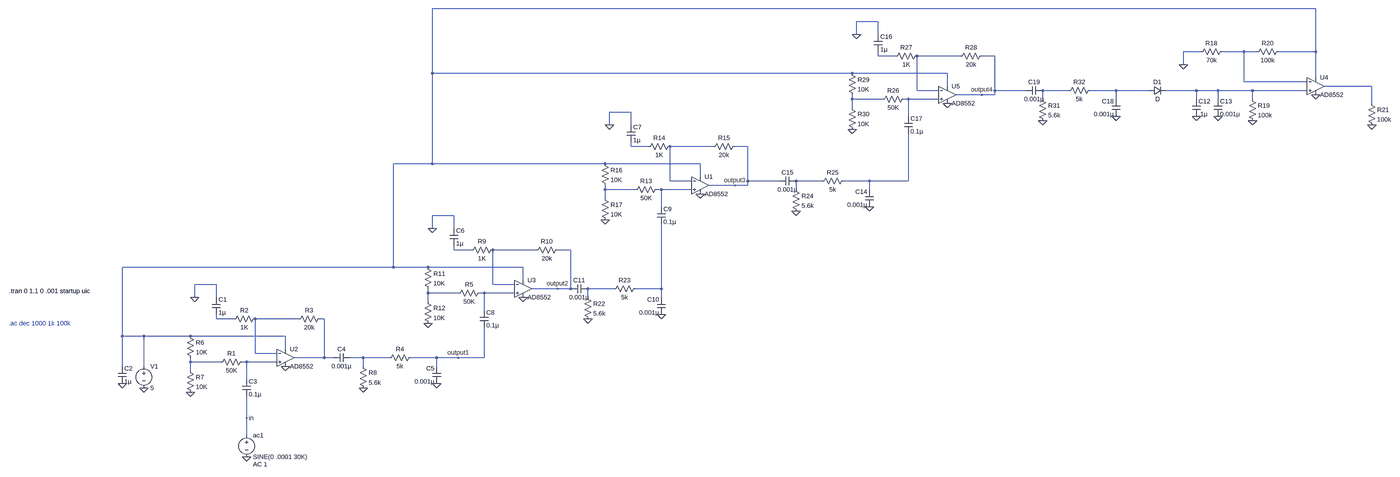
[diagram p0: schematic Kyles Amp Circuit.asc, whole sheet]
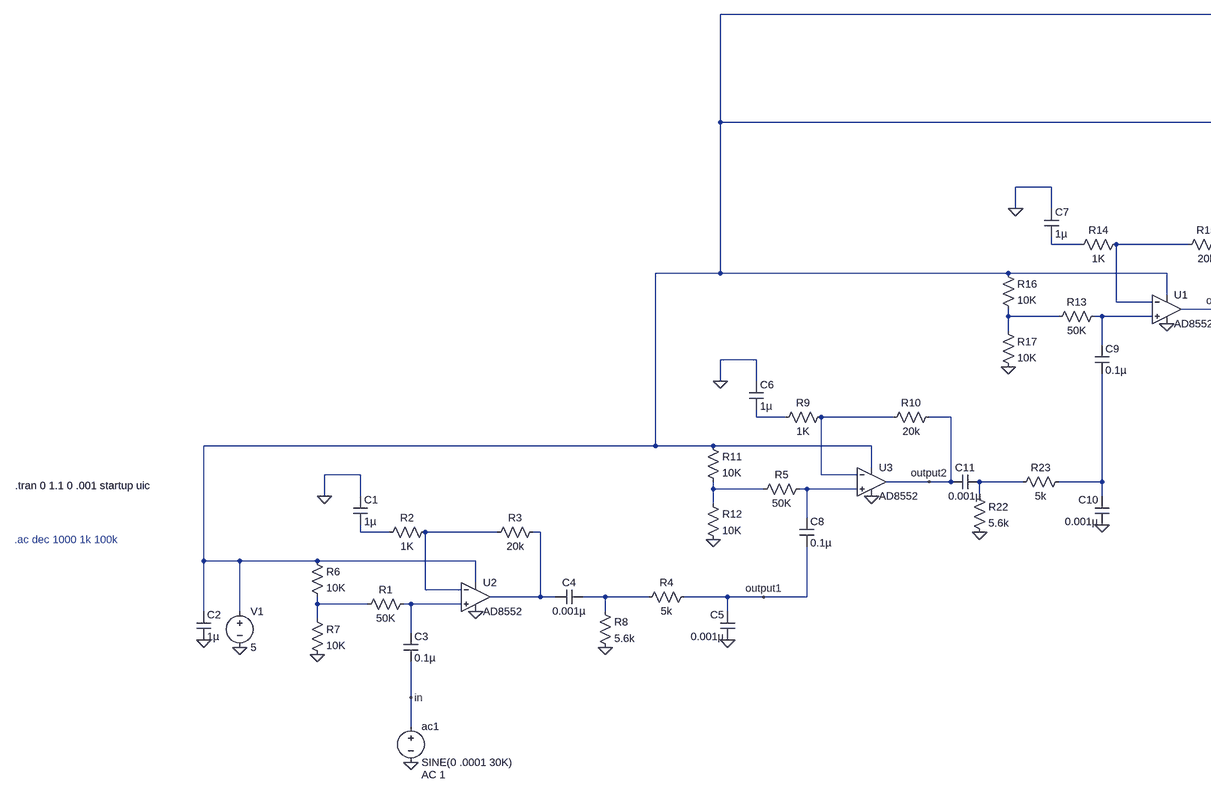
[diagram p1: schematic Kyles Amp Circuit.asc, part, row 1 of 1, column 1 of 2]
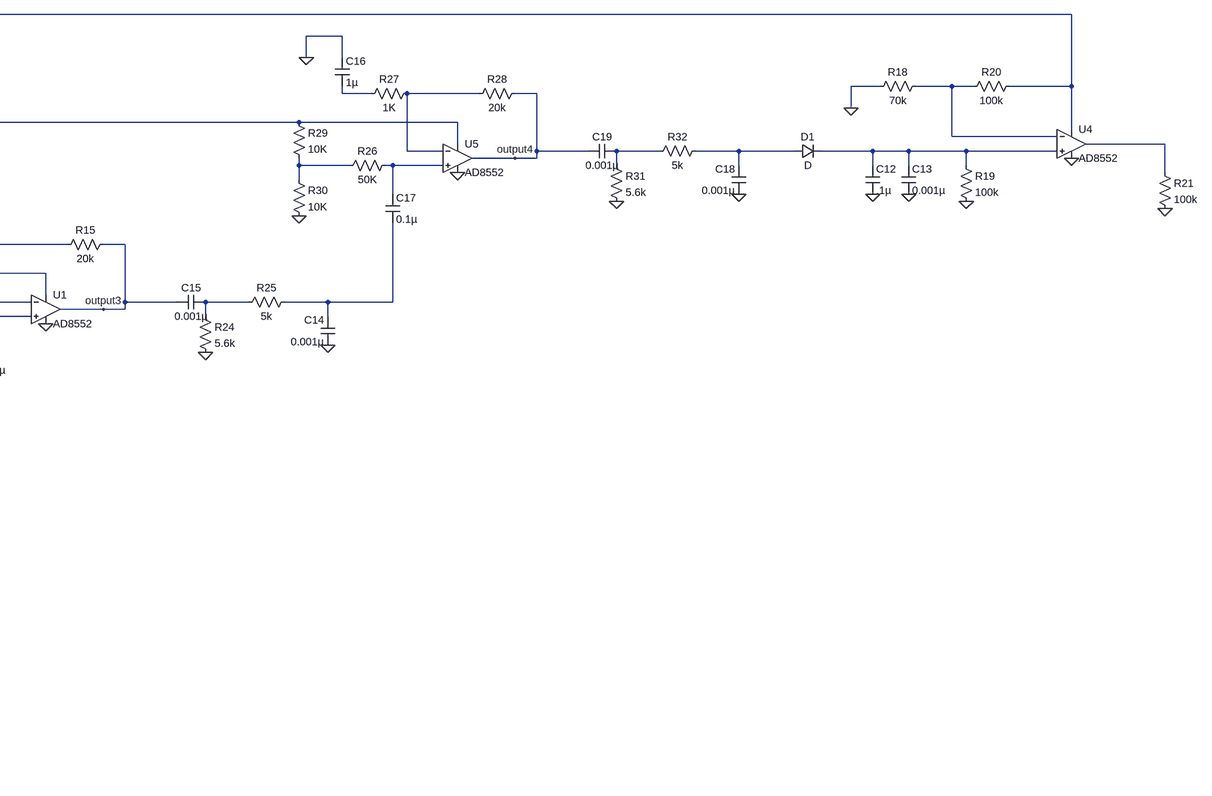
[diagram p2: schematic Kyles Amp Circuit.asc, part, row 1 of 1, column 2 of 2]
Kyles Amp Circuit.asc, the LTspice schematic file:
Version 4
SHEET 1 4688 692
WIRE 4400 -1168 992 -1168
WIRE 2688 -1120 2608 -1120
WIRE 2608 -1072 2608 -1120
WIRE 2688 -1072 2688 -1120
WIRE 3936 -1008 3872 -1008
WIRE 4096 -1008 4016 -1008
WIRE 4144 -1008 4096 -1008
WIRE 4400 -1008 4400 -1168
WIRE 4400 -1008 4224 -1008
WIRE 2688 -992 2688 -1008
WIRE 2752 -992 2688 -992
WIRE 2992 -992 2832 -992
WIRE 3120 -992 3072 -992
WIRE 3872 -960 3872 -1008
WIRE 992 -928 992 -1168
WIRE 2592 -928 992 -928
WIRE 2944 -928 2592 -928
WIRE 4400 -912 4400 -1008
WIRE 4096 -896 4096 -1008
WIRE 4368 -896 4096 -896
WIRE 2944 -880 2944 -928
WIRE 4608 -880 4432 -880
WIRE 2832 -864 2832 -992
WIRE 2912 -864 2832 -864
WIRE 3120 -864 3120 -992
WIRE 3280 -864 3120 -864
WIRE 3440 -864 3344 -864
WIRE 3616 -864 3520 -864
WIRE 3744 -864 3616 -864
WIRE 3920 -864 3808 -864
WIRE 4000 -864 3920 -864
WIRE 4128 -864 4000 -864
WIRE 4368 -864 4128 -864
WIRE 3072 -848 2976 -848
WIRE 3120 -848 3120 -864
WIRE 3120 -848 3072 -848
WIRE 2592 -832 2592 -848
WIRE 2704 -832 2592 -832
WIRE 2800 -832 2784 -832
WIRE 2912 -832 2800 -832
WIRE 3344 -832 3344 -864
WIRE 3616 -832 3616 -864
WIRE 3920 -832 3920 -864
WIRE 4000 -832 4000 -864
WIRE 4128 -832 4128 -864
WIRE 4608 -816 4608 -880
WIRE 2592 -800 2592 -832
WIRE 1728 -784 1648 -784
WIRE 2800 -768 2800 -832
WIRE 1648 -736 1648 -784
WIRE 1728 -736 1728 -784
WIRE 1728 -656 1728 -672
WIRE 1792 -656 1728 -656
WIRE 2032 -656 1872 -656
WIRE 2160 -656 2112 -656
WIRE 992 -592 992 -928
WIRE 992 -592 848 -592
WIRE 1632 -592 992 -592
WIRE 1984 -592 1632 -592
WIRE 1984 -544 1984 -592
WIRE 1872 -528 1872 -656
WIRE 1952 -528 1872 -528
WIRE 2160 -528 2160 -656
WIRE 2320 -528 2160 -528
WIRE 2480 -528 2384 -528
WIRE 2656 -528 2560 -528
WIRE 2800 -528 2800 -704
WIRE 2800 -528 2656 -528
WIRE 2112 -512 2016 -512
WIRE 2160 -512 2160 -528
WIRE 2160 -512 2112 -512
WIRE 1632 -496 1632 -512
WIRE 1744 -496 1632 -496
WIRE 1840 -496 1824 -496
WIRE 1952 -496 1840 -496
WIRE 2384 -496 2384 -528
WIRE 2656 -496 2656 -528
WIRE 1632 -464 1632 -496
WIRE 1840 -432 1840 -496
WIRE 1072 -400 992 -400
WIRE 992 -352 992 -400
WIRE 1072 -352 1072 -400
WIRE 1072 -272 1072 -288
WIRE 1136 -272 1072 -272
WIRE 1376 -272 1216 -272
WIRE 1504 -272 1456 -272
WIRE 848 -208 848 -592
WIRE 848 -208 -240 -208
WIRE 976 -208 848 -208
WIRE 1328 -208 976 -208
WIRE 1328 -160 1328 -208
WIRE 192 -144 112 -144
WIRE 1216 -144 1216 -272
WIRE 1296 -144 1216 -144
WIRE 1456 -128 1360 -128
WIRE 1504 -128 1504 -272
WIRE 1504 -128 1456 -128
WIRE 1664 -128 1568 -128
WIRE 1840 -128 1840 -368
WIRE 1840 -128 1744 -128
WIRE 976 -112 976 -128
WIRE 1088 -112 976 -112
WIRE 1184 -112 1168 -112
WIRE 1296 -112 1184 -112
WIRE 112 -96 112 -144
WIRE 192 -96 192 -144
WIRE 1568 -96 1568 -128
WIRE 1840 -96 1840 -128
WIRE 976 -80 976 -112
WIRE 1184 -48 1184 -112
WIRE 192 -16 192 -32
WIRE 256 -16 192 -16
WIRE 496 -16 336 -16
WIRE 592 -16 576 -16
WIRE -240 48 -240 -208
WIRE -160 48 -240 48
WIRE 96 48 -160 48
WIRE 448 48 96 48
WIRE 448 96 448 48
WIRE 336 112 336 -16
WIRE 416 112 336 112
WIRE 592 128 592 -16
WIRE 592 128 480 128
WIRE 624 128 592 128
WIRE 736 128 688 128
WIRE 832 128 736 128
WIRE 1008 128 912 128
WIRE 1088 128 1008 128
WIRE 1184 128 1184 16
WIRE 1184 128 1088 128
WIRE 96 144 96 128
WIRE 208 144 96 144
WIRE 304 144 288 144
WIRE 416 144 304 144
WIRE -240 160 -240 48
WIRE -160 160 -160 48
WIRE 736 160 736 128
WIRE 1008 160 1008 128
WIRE 96 176 96 144
WIRE 304 208 304 144
WIRE 304 352 304 272
WIRE 304 416 304 352
FLAG 112 -96 0
FLAG 304 496 0
FLAG 448 160 0
FLAG -160 240 0
FLAG -240 224 0
FLAG 96 256 0
FLAG 736 240 0
FLAG 1008 224 0
FLAG 992 -352 0
FLAG 1328 -96 0
FLAG 976 0 0
FLAG 1648 -736 0
FLAG 1984 -480 0
FLAG 1632 -384 0
FLAG 2112 -512 output3
FLAG 1456 -128 output2
FLAG 1088 128 output1
FLAG 304 352 in
FLAG 3920 -768 0
FLAG 4000 -768 0
FLAG 4128 -752 0
FLAG 4400 -848 0
FLAG 3872 -960 0
FLAG 4608 -736 0
FLAG 1568 -16 0
FLAG 1840 -32 0
FLAG 2384 -416 0
FLAG 2656 -432 0
FLAG 2608 -1072 0
FLAG 2944 -816 0
FLAG 2592 -720 0
FLAG 3072 -848 output4
FLAG 3344 -752 0
FLAG 3616 -768 0
SYMBOL voltage -160 144 R0
WINDOW 123 0 0 Left 0
WINDOW 39 0 0 Left 0
SYMATTR InstName V1
SYMATTR Value 5
SYMBOL voltage 304 400 R0
WINDOW 123 24 124 Left 2
WINDOW 39 0 0 Left 0
SYMATTR Value2 AC 1
SYMATTR InstName ac1
SYMATTR Value SINE(0 .0001 30K)
SYMBOL res 304 128 R90
WINDOW 0 0 56 VBottom 2
WINDOW 3 32 56 VTop 2
SYMATTR InstName R1
SYMATTR Value 50K
SYMBOL res 352 -32 R90
WINDOW 0 0 56 VBottom 2
WINDOW 3 32 56 VTop 2
SYMATTR InstName R2
SYMATTR Value 1K
SYMBOL res 592 -32 R90
WINDOW 0 0 56 VBottom 2
WINDOW 3 32 56 VTop 2
SYMATTR InstName R3
SYMATTR Value 20k
SYMBOL cap 176 -96 R0
SYMATTR InstName C1
SYMATTR Value 1µ
SYMBOL cap -256 160 R0
SYMATTR InstName C2
SYMATTR Value 1µ
SYMBOL cap 288 208 R0
SYMATTR InstName C3
SYMATTR Value 0.1µ
SYMBOL res 80 32 R0
SYMATTR InstName R6
SYMATTR Value 10K
SYMBOL res 80 160 R0
SYMATTR InstName R7
SYMATTR Value 10K
SYMBOL cap 688 112 R90
WINDOW 0 0 32 VBottom 2
WINDOW 3 32 32 VTop 2
SYMATTR InstName C4
SYMATTR Value 0.001µ
SYMBOL res 720 144 R0
SYMATTR InstName R8
SYMATTR Value 5.6k
SYMBOL cap 1024 224 R180
WINDOW 0 24 56 Left 2
WINDOW 3 24 8 Left 2
SYMATTR InstName C5
SYMATTR Value 0.001µ
SYMBOL res 928 112 R90
WINDOW 0 0 56 VBottom 2
WINDOW 3 32 56 VTop 2
SYMATTR InstName R4
SYMATTR Value 5k
SYMBOL Opamps\\AD8552 448 64 R0
SYMATTR InstName U2
SYMBOL res 1184 -128 R90
WINDOW 0 0 56 VBottom 2
WINDOW 3 32 56 VTop 2
SYMATTR InstName R5
SYMATTR Value 50K
SYMBOL res 1232 -288 R90
WINDOW 0 0 56 VBottom 2
WINDOW 3 32 56 VTop 2
SYMATTR InstName R9
SYMATTR Value 1K
SYMBOL res 1472 -288 R90
WINDOW 0 0 56 VBottom 2
WINDOW 3 32 56 VTop 2
SYMATTR InstName R10
SYMATTR Value 20k
SYMBOL cap 1056 -352 R0
SYMATTR InstName C6
SYMATTR Value 1µ
SYMBOL cap 1168 -48 R0
SYMATTR InstName C8
SYMATTR Value 0.1µ
SYMBOL res 960 -224 R0
SYMATTR InstName R11
SYMATTR Value 10K
SYMBOL res 960 -96 R0
SYMATTR InstName R12
SYMATTR Value 10K
SYMBOL Opamps\\AD8552 1328 -192 R0
SYMATTR InstName U3
SYMBOL res 1840 -512 R90
WINDOW 0 0 56 VBottom 2
WINDOW 3 32 56 VTop 2
SYMATTR InstName R13
SYMATTR Value 50K
SYMBOL res 1888 -672 R90
WINDOW 0 0 56 VBottom 2
WINDOW 3 32 56 VTop 2
SYMATTR InstName R14
SYMATTR Value 1K
SYMBOL res 2128 -672 R90
WINDOW 0 0 56 VBottom 2
WINDOW 3 32 56 VTop 2
SYMATTR InstName R15
SYMATTR Value 20k
SYMBOL cap 1712 -736 R0
SYMATTR InstName C7
SYMATTR Value 1µ
SYMBOL cap 1824 -432 R0
SYMATTR InstName C9
SYMATTR Value 0.1µ
SYMBOL res 1616 -608 R0
SYMATTR InstName R16
SYMATTR Value 10K
SYMBOL res 1616 -480 R0
SYMATTR InstName R17
SYMATTR Value 10K
SYMBOL Opamps\\AD8552 1984 -576 R0
SYMATTR InstName U1
SYMBOL diode 3744 -848 R270
WINDOW 0 32 32 VTop 2
WINDOW 3 0 32 VBottom 2
SYMATTR InstName D1
SYMBOL cap 3904 -832 R0
SYMATTR InstName C12
SYMATTR Value .1µ
SYMBOL cap 3984 -832 R0
SYMATTR InstName C13
SYMATTR Value 0.001µ
SYMBOL res 4112 -848 R0
SYMATTR InstName R19
SYMATTR Value 100k
SYMBOL Opamps\\AD8552 4400 -944 R0
SYMATTR InstName U4
SYMBOL res 4032 -1024 R90
WINDOW 0 0 56 VBottom 2
WINDOW 3 32 56 VTop 2
SYMATTR InstName R18
SYMATTR Value 70k
SYMBOL res 4240 -1024 R90
WINDOW 0 0 56 VBottom 2
WINDOW 3 32 56 VTop 2
SYMATTR InstName R20
SYMATTR Value 100k
SYMBOL res 4592 -832 R0
SYMATTR InstName R21
SYMATTR Value 100k
SYMBOL res 1552 -112 R0
SYMATTR InstName R22
SYMATTR Value 5.6k
SYMBOL cap 1856 -32 R180
WINDOW 0 24 56 Left 2
WINDOW 3 24 8 Left 2
SYMATTR InstName C10
SYMATTR Value 0.001µ
SYMBOL res 1760 -144 R90
WINDOW 0 0 56 VBottom 2
WINDOW 3 32 56 VTop 2
SYMATTR InstName R23
SYMATTR Value 5k
SYMBOL cap 1568 -144 R90
WINDOW 0 0 32 VBottom 2
WINDOW 3 32 32 VTop 2
SYMATTR InstName C11
SYMATTR Value 0.001µ
SYMBOL res 2368 -512 R0
SYMATTR InstName R24
SYMATTR Value 5.6k
SYMBOL cap 2672 -432 R180
WINDOW 0 24 56 Left 2
WINDOW 3 24 8 Left 2
SYMATTR InstName C14
SYMATTR Value 0.001µ
SYMBOL res 2576 -544 R90
WINDOW 0 0 56 VBottom 2
WINDOW 3 32 56 VTop 2
SYMATTR InstName R25
SYMATTR Value 5k
SYMBOL cap 2384 -544 R90
WINDOW 0 0 32 VBottom 2
WINDOW 3 32 32 VTop 2
SYMATTR InstName C15
SYMATTR Value 0.001µ
SYMBOL res 2800 -848 R90
WINDOW 0 0 56 VBottom 2
WINDOW 3 32 56 VTop 2
SYMATTR InstName R26
SYMATTR Value 50K
SYMBOL res 2848 -1008 R90
WINDOW 0 0 56 VBottom 2
WINDOW 3 32 56 VTop 2
SYMATTR InstName R27
SYMATTR Value 1K
SYMBOL res 3088 -1008 R90
WINDOW 0 0 56 VBottom 2
WINDOW 3 32 56 VTop 2
SYMATTR InstName R28
SYMATTR Value 20k
SYMBOL cap 2672 -1072 R0
SYMATTR InstName C16
SYMATTR Value 1µ
SYMBOL cap 2784 -768 R0
SYMATTR InstName C17
SYMATTR Value 0.1µ
SYMBOL res 2576 -944 R0
SYMATTR InstName R29
SYMATTR Value 10K
SYMBOL res 2576 -816 R0
SYMATTR InstName R30
SYMATTR Value 10K
SYMBOL Opamps\\AD8552 2944 -912 R0
SYMATTR InstName U5
SYMBOL res 3328 -848 R0
SYMATTR InstName R31
SYMATTR Value 5.6k
SYMBOL cap 3632 -768 R180
WINDOW 0 24 56 Left 2
WINDOW 3 24 8 Left 2
SYMATTR InstName C18
SYMATTR Value 0.001µ
SYMBOL res 3536 -880 R90
WINDOW 0 0 56 VBottom 2
WINDOW 3 32 56 VTop 2
SYMATTR InstName R32
SYMATTR Value 5k
SYMBOL cap 3344 -880 R90
WINDOW 0 0 32 VBottom 2
WINDOW 3 32 32 VTop 2
SYMATTR InstName C19
SYMATTR Value 0.001µ
TEXT -1032 -120 Left 2 !.tran 0 1.1 0 .001 startup uic
TEXT -1034 0 Left 2 ;.ac dec 1000 1k 100k

The netlist it stands for:
* Kyles Amp Circuit.asc
V1 N001 0 5
V§ac1 in 0 SINE(0 .0001 30K) AC 1
R1 N028 N027 50K
R2 N024 N023 1K
R3 N025 N024 20k
C1 0 N023 1µ
C2 N001 0 1µ
C3 N028 in 0.1µ
R6 N001 N027 10K
R7 N027 0 10K
C4 N026 N025 0.001µ
R8 N026 0 5.6k
C5 0 output1 0.001µ
R4 output1 N026 5k
XU2 N028 N024 N001 0 N025 AD8552  ; pins In+ In- V+ V- OUT
R5 N022 N021 50K
R9 N018 N017 1K
R10 output2 N018 20k
C6 0 N017 1µ
C8 N022 output1 0.1µ
R11 N001 N021 10K
R12 N021 0 10K
XU3 N022 N018 N001 0 output2 AD8552  ; pins In+ In- V+ V- OUT
R13 N016 N015 50K
R14 N012 N011 1K
R15 output3 N012 20k
C7 0 N011 1µ
C9 N016 N020 0.1µ
R16 N001 N015 10K
R17 N015 0 10K
XU1 N016 N012 N001 0 output3 AD8552  ; pins In+ In- V+ V- OUT
D1 N007 N008 D
C12 N008 0 .1µ
C13 N008 0 0.001µ
R19 N008 0 100k
XU4 N008 N002 N001 0 N005 AD8552  ; pins In+ In- V+ V- OUT
R18 N002 0 70k
R20 N001 N002 100k
R21 N005 0 100k
R22 N019 0 5.6k
C10 0 N020 0.001µ
R23 N020 N019 5k
C11 N019 output2 0.001µ
R24 N013 0 5.6k
C14 0 N014 0.001µ
R25 N014 N013 5k
C15 N013 output3 0.001µ
R26 N010 N009 50K
R27 N004 N003 1K
R28 output4 N004 20k
C16 0 N003 1µ
C17 N010 N014 0.1µ
R29 N001 N009 10K
R30 N009 0 10K
XU5 N010 N004 N001 0 output4 AD8552  ; pins In+ In- V+ V- OUT
R31 N006 0 5.6k
C18 0 N007 0.001µ
R32 N007 N006 5k
C19 N006 output4 0.001µ
.model D D
.lib standard.dio
.tran 0 1.1 0 .001 startup uic
* .ac dec 1000 1k 100k
.backanno
.end